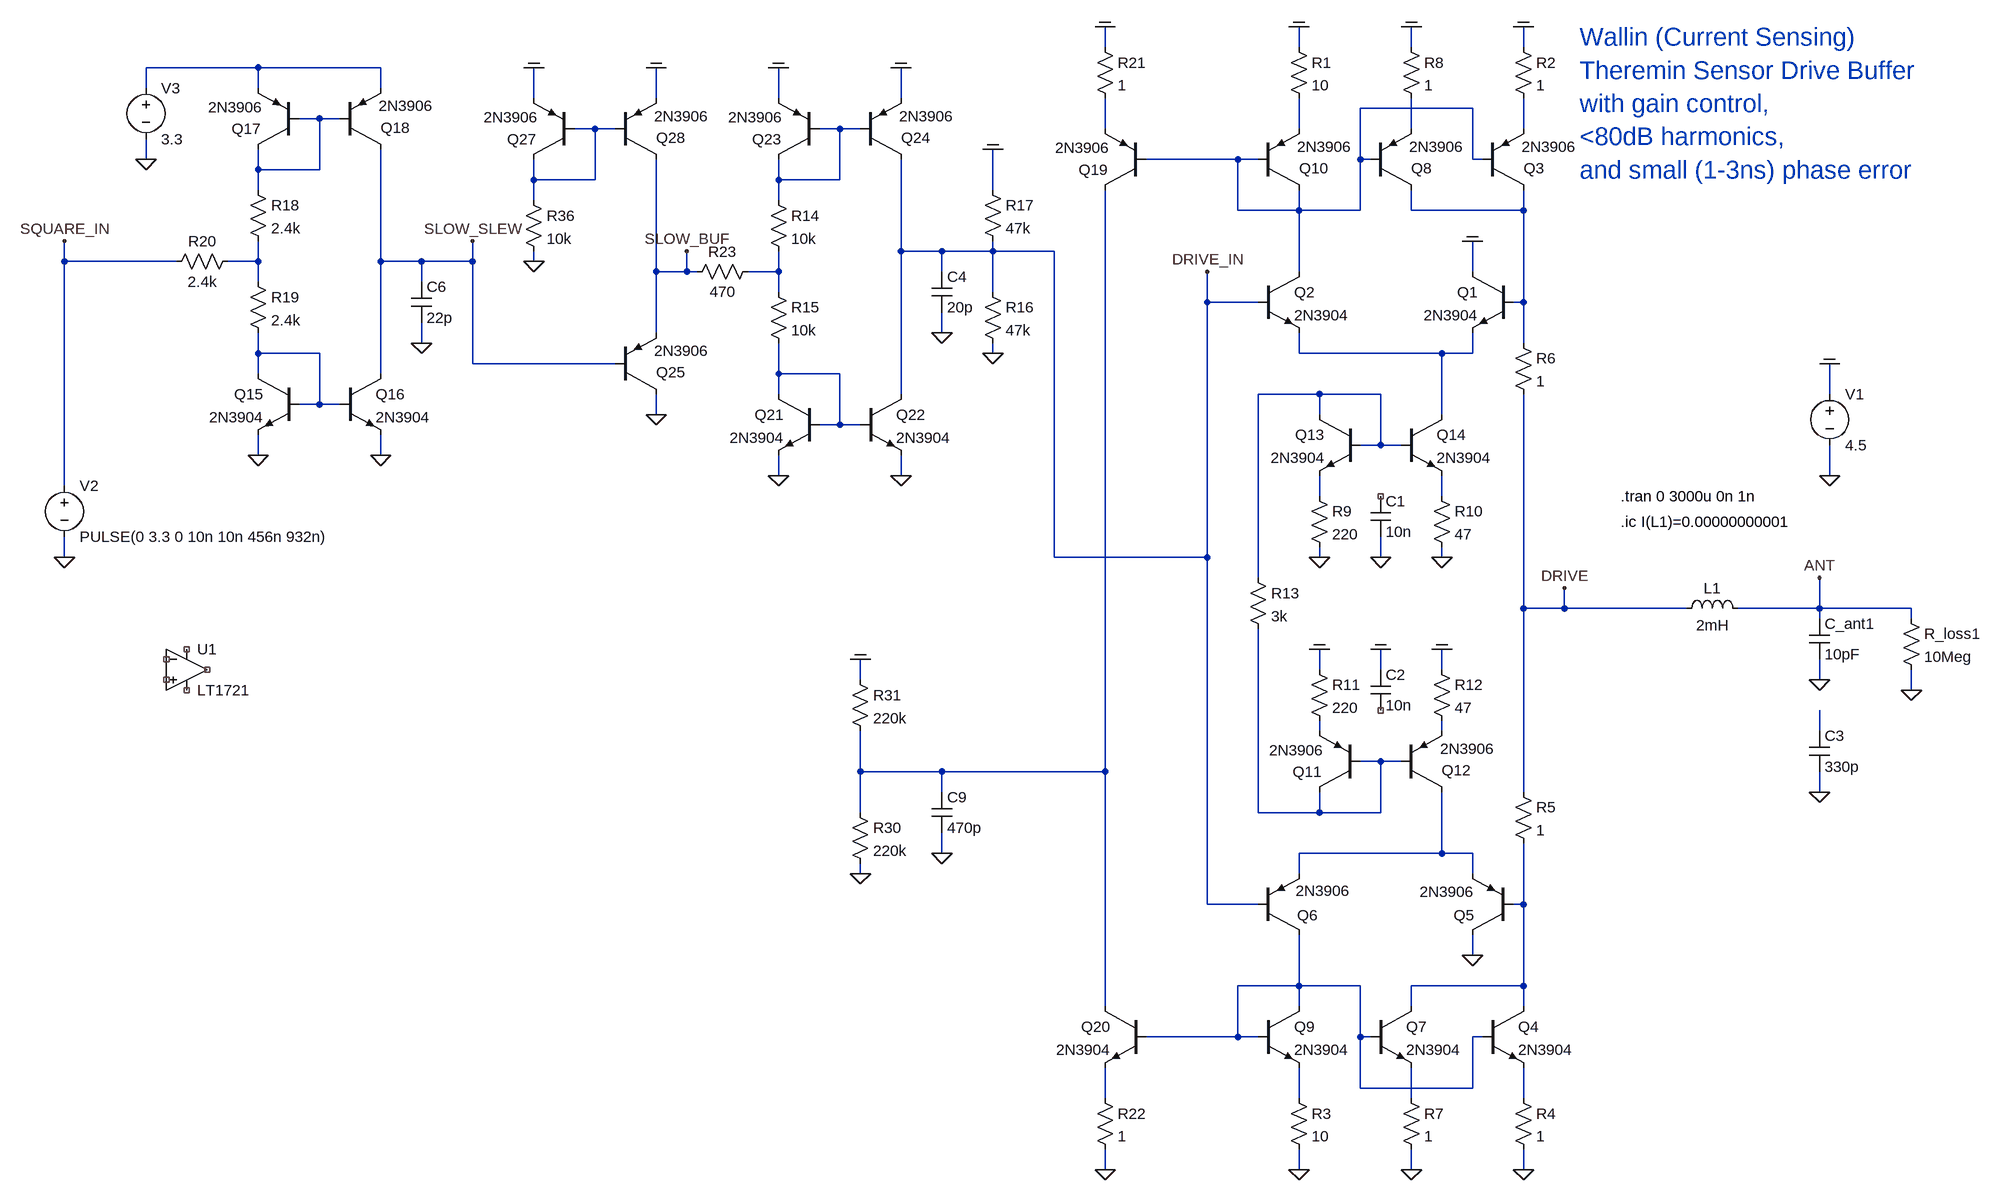
[diagram p0: schematic dlev_afe_bjt_current_sense.asc]
dlev_afe_bjt_current_sense.asc, the LTspice schematic file:
Version 4
SHEET 1 880 1584
WIRE -496 -192 -496 -224
WIRE -192 -192 -192 -224
WIRE -16 -192 -16 -224
WIRE 160 -192 160 -224
WIRE -1824 -160 -2000 -160
WIRE -1632 -160 -1824 -160
WIRE -2000 -128 -2000 -160
WIRE -1824 -128 -1824 -160
WIRE -1632 -128 -1632 -160
WIRE -1392 -112 -1392 -160
WIRE -1200 -112 -1200 -160
WIRE -1008 -112 -1008 -160
WIRE -816 -112 -816 -160
WIRE 80 -96 -96 -96
WIRE -1728 -80 -1760 -80
WIRE -1696 -80 -1728 -80
WIRE -1296 -64 -1328 -64
WIRE -1264 -64 -1296 -64
WIRE -912 -64 -944 -64
WIRE -880 -64 -912 -64
WIRE -496 -64 -496 -112
WIRE -192 -64 -192 -112
WIRE -16 -64 -16 -112
WIRE 160 -64 160 -112
WIRE -2000 -16 -2000 -48
WIRE -288 -16 -432 -16
WIRE -256 -16 -288 -16
WIRE -96 -16 -96 -96
WIRE -80 -16 -96 -16
WIRE 80 -16 80 -96
WIRE 96 -16 80 -16
WIRE -1824 0 -1824 -32
WIRE -1728 0 -1728 -80
WIRE -1728 0 -1824 0
WIRE -1392 16 -1392 -16
WIRE -1296 16 -1296 -64
WIRE -1296 16 -1392 16
WIRE -1008 16 -1008 -16
WIRE -912 16 -912 -64
WIRE -912 16 -1008 16
WIRE -1824 32 -1824 0
WIRE -672 32 -672 -32
WIRE -1392 48 -1392 16
WIRE -1008 48 -1008 16
WIRE -288 64 -288 -16
WIRE -192 64 -192 32
WIRE -192 64 -288 64
WIRE -96 64 -96 -16
WIRE -96 64 -192 64
WIRE -16 64 -16 32
WIRE 160 64 160 32
WIRE 160 64 -16 64
WIRE -816 128 -816 -16
WIRE -752 128 -816 128
WIRE -672 128 -672 112
WIRE -672 128 -752 128
WIRE -576 128 -672 128
WIRE -2128 144 -2128 112
WIRE -1952 144 -2128 144
WIRE -1824 144 -1824 112
WIRE -1824 144 -1872 144
WIRE -1632 144 -1632 -32
WIRE -1568 144 -1632 144
WIRE -1488 144 -1488 112
WIRE -1488 144 -1568 144
WIRE -1392 144 -1392 128
WIRE -1200 160 -1200 -16
WIRE -1152 160 -1152 128
WIRE -1152 160 -1200 160
WIRE -1136 160 -1152 160
WIRE -1008 160 -1008 128
WIRE -1008 160 -1056 160
WIRE -752 160 -752 128
WIRE -192 160 -192 64
WIRE 80 160 80 112
WIRE -1824 176 -1824 144
WIRE -1568 176 -1568 144
WIRE -1008 192 -1008 160
WIRE -672 192 -672 128
WIRE -336 208 -336 160
WIRE -256 208 -336 208
WIRE 160 208 160 64
WIRE 160 208 144 208
WIRE -1200 256 -1200 160
WIRE -752 256 -752 224
WIRE -1568 272 -1568 240
WIRE 160 272 160 208
WIRE -1824 288 -1824 256
WIRE -1728 288 -1824 288
WIRE -672 288 -672 272
WIRE -192 288 -192 256
WIRE 32 288 -192 288
WIRE 80 288 80 256
WIRE 80 288 32 288
WIRE -1488 304 -1488 144
WIRE -1264 304 -1488 304
WIRE -1824 320 -1824 288
WIRE -1632 320 -1632 144
WIRE -1008 320 -1008 272
WIRE -912 320 -1008 320
WIRE -1008 352 -1008 320
WIRE -816 352 -816 128
WIRE -160 352 -256 352
WIRE -64 352 -160 352
WIRE 640 352 640 304
WIRE -1728 368 -1728 288
WIRE -1728 368 -1760 368
WIRE -1696 368 -1728 368
WIRE -1200 384 -1200 352
WIRE -160 384 -160 352
WIRE 32 384 32 288
WIRE -912 400 -912 320
WIRE -912 400 -944 400
WIRE -880 400 -912 400
WIRE -64 432 -64 352
WIRE -64 432 -96 432
WIRE -32 432 -64 432
WIRE -1824 448 -1824 416
WIRE -1632 448 -1632 416
WIRE -1008 480 -1008 448
WIRE -816 480 -816 448
WIRE 640 480 640 432
WIRE -2128 496 -2128 144
WIRE -160 512 -160 480
WIRE 32 512 32 480
WIRE -2128 608 -2128 576
WIRE -576 608 -576 128
WIRE -336 608 -336 208
WIRE -336 608 -576 608
WIRE -160 608 -160 592
WIRE -64 608 -64 576
WIRE 32 608 32 592
WIRE -256 640 -256 352
WIRE 160 688 160 352
WIRE 224 688 224 656
WIRE 224 688 160 688
WIRE 416 688 224 688
WIRE 624 688 624 640
WIRE 624 688 496 688
WIRE 768 688 624 688
WIRE 624 704 624 688
WIRE 768 704 768 688
WIRE -160 784 -160 752
WIRE -64 784 -64 752
WIRE 32 784 32 752
WIRE -880 800 -880 768
WIRE 624 800 624 768
WIRE 768 816 768 784
WIRE -160 880 -160 864
WIRE 32 880 32 864
WIRE 624 880 624 848
WIRE -64 928 -96 928
WIRE -32 928 -64 928
WIRE -880 944 -880 880
WIRE -752 944 -880 944
WIRE -496 944 -496 32
WIRE -496 944 -752 944
WIRE -752 976 -752 944
WIRE 160 976 160 688
WIRE 624 976 624 944
WIRE -880 1008 -880 944
WIRE -256 1008 -256 720
WIRE -160 1008 -160 976
WIRE -160 1008 -256 1008
WIRE -64 1008 -64 928
WIRE -64 1008 -160 1008
WIRE -752 1072 -752 1040
WIRE 32 1072 32 976
WIRE 32 1072 -192 1072
WIRE 80 1072 32 1072
WIRE -880 1104 -880 1088
WIRE -192 1104 -192 1072
WIRE 80 1104 80 1072
WIRE -336 1152 -336 608
WIRE -256 1152 -336 1152
WIRE 160 1152 160 1056
WIRE 160 1152 144 1152
WIRE 80 1232 80 1200
WIRE -192 1280 -192 1200
WIRE -192 1280 -288 1280
WIRE -96 1280 -192 1280
WIRE 160 1280 160 1152
WIRE 160 1280 -16 1280
WIRE -496 1312 -496 944
WIRE -192 1312 -192 1280
WIRE -16 1312 -16 1280
WIRE 160 1312 160 1280
WIRE -288 1360 -288 1280
WIRE -288 1360 -432 1360
WIRE -256 1360 -288 1360
WIRE -96 1360 -96 1280
WIRE -80 1360 -96 1360
WIRE 96 1360 80 1360
WIRE -96 1440 -96 1360
WIRE 80 1440 80 1360
WIRE 80 1440 -96 1440
WIRE -496 1456 -496 1408
WIRE -192 1456 -192 1408
WIRE -16 1456 -16 1408
WIRE 160 1456 160 1408
WIRE -496 1568 -496 1536
WIRE -192 1568 -192 1536
WIRE -16 1568 -16 1536
WIRE 160 1568 160 1536
FLAG 640 480 0
FLAG 640 304 COM
FLAG -192 -224 COM
FLAG 160 -224 COM
FLAG 80 112 COM
FLAG -192 1568 0
FLAG 160 1568 0
FLAG 80 1232 0
FLAG 624 800 0
FLAG 624 640 ANT
FLAG 224 656 DRIVE
FLAG 768 816 0
FLAG -336 160 DRIVE_IN
FLAG -16 1568 0
FLAG -16 -224 COM
FLAG -160 752 COM
FLAG 32 752 COM
FLAG -160 608 0
FLAG 32 608 0
FLAG -64 608 0
FLAG -64 752 COM
FLAG 624 976 0
FLAG -2128 608 0
FLAG -1824 448 0
FLAG -1632 448 0
FLAG -1568 272 0
FLAG -2000 -16 0
FLAG -880 1104 0
FLAG -752 1072 0
FLAG -1392 -160 COM
FLAG -1200 -160 COM
FLAG -1392 144 0
FLAG -1200 384 0
FLAG -496 -224 COM
FLAG -496 1568 0
FLAG -880 768 COM
FLAG -1008 480 0
FLAG -816 480 0
FLAG -752 256 0
FLAG -1008 -160 COM
FLAG -816 -160 COM
FLAG -672 288 0
FLAG -672 -32 COM
FLAG -2128 112 SQUARE_IN
FLAG -1488 112 SLOW_SLEW
FLAG -1152 128 SLOW_BUF
SYMBOL voltage 640 336 R0
SYMATTR InstName V1
SYMATTR Value 4.5
SYMBOL npn 144 160 M0
SYMATTR InstName Q1
SYMATTR Value 2N3904
SYMBOL npn -256 160 R0
SYMATTR InstName Q2
SYMATTR Value 2N3904
SYMBOL Res -208 -208 R0
SYMATTR InstName R1
SYMATTR Value 10
SYMBOL pnp 96 32 M180
WINDOW 0 64 34 Left 2
WINDOW 3 61 68 Left 2
SYMATTR InstName Q3
SYMATTR Value 2N3906
SYMBOL Res 144 -208 R0
SYMATTR InstName R2
SYMATTR Value 1
SYMBOL npn 96 1312 R0
SYMATTR InstName Q4
SYMATTR Value 2N3904
SYMBOL Res -208 1440 R0
SYMATTR InstName R3
SYMATTR Value 10
SYMBOL Res 144 1440 R0
SYMATTR InstName R4
SYMATTR Value 1
SYMBOL pnp 144 1200 R180
WINDOW 0 61 31 Left 2
WINDOW 3 62 68 Left 2
SYMATTR InstName Q5
SYMATTR Value 2N3906
SYMBOL pnp -256 1200 M180
WINDOW 0 61 31 Left 2
WINDOW 3 59 69 Left 2
SYMATTR InstName Q6
SYMATTR Value 2N3906
SYMBOL Res 144 960 R0
SYMATTR InstName R5
SYMATTR Value 1
SYMBOL Res 144 256 R0
SYMATTR InstName R6
SYMATTR Value 1
SYMBOL ind 400 704 R270
WINDOW 0 32 56 VTop 2
WINDOW 3 5 56 VBottom 2
SYMATTR InstName L1
SYMATTR Value 2mH
SYMATTR SpiceLine Rser=120 Cpar=1pF
SYMBOL Cap 608 704 R0
SYMATTR InstName C_ant1
SYMATTR Value 10pF
SYMBOL Res 752 688 R0
SYMATTR InstName R_loss1
SYMATTR Value 10Meg
SYMBOL npn -80 1312 R0
SYMATTR InstName Q7
SYMATTR Value 2N3904
SYMBOL Res -32 1440 R0
SYMATTR InstName R7
SYMATTR Value 1
SYMBOL pnp -80 32 M180
WINDOW 0 64 34 Left 2
WINDOW 3 61 68 Left 2
SYMATTR InstName Q8
SYMATTR Value 2N3906
SYMBOL Res -32 -208 R0
SYMATTR InstName R8
SYMATTR Value 1
SYMBOL npn -256 1312 R0
SYMATTR InstName Q9
SYMATTR Value 2N3904
SYMBOL pnp -256 32 M180
WINDOW 0 64 34 Left 2
WINDOW 3 61 68 Left 2
SYMATTR InstName Q10
SYMATTR Value 2N3906
SYMBOL pnp -96 976 R180
WINDOW 0 60 32 Left 2
WINDOW 3 58 66 Left 2
SYMATTR InstName Q11
SYMATTR Value 2N3906
SYMBOL pnp -32 976 M180
WINDOW 0 64 34 Left 2
WINDOW 3 61 68 Left 2
SYMATTR InstName Q12
SYMATTR Value 2N3906
SYMBOL npn -96 384 M0
SYMATTR InstName Q13
SYMATTR Value 2N3904
SYMBOL npn -32 384 R0
SYMATTR InstName Q14
SYMATTR Value 2N3904
SYMBOL Res -176 496 R0
SYMATTR InstName R9
SYMATTR Value 220
SYMBOL Res 16 496 R0
SYMATTR InstName R10
SYMATTR Value 47
SYMBOL Res -176 768 R0
SYMATTR InstName R11
SYMATTR Value 220
SYMBOL Res 16 768 R0
SYMATTR InstName R12
SYMATTR Value 47
SYMBOL Res -272 624 R0
SYMATTR InstName R13
SYMATTR Value 3k
SYMBOL Cap -80 512 R0
SYMATTR InstName C1
SYMATTR Value 10n
SYMBOL Cap -80 784 R0
SYMATTR InstName C2
SYMATTR Value 10n
SYMBOL Cap 608 880 R0
SYMATTR InstName C3
SYMATTR Value 330p
SYMBOL Voltage -2128 480 R0
SYMATTR InstName V2
SYMATTR Value PULSE(0 3.3 0 10n 10n 456n 932n)
SYMBOL Voltage -2000 -144 R0
SYMATTR InstName V3
SYMATTR Value 3.3
SYMBOL npn -1760 320 M0
SYMATTR InstName Q15
SYMATTR Value 2N3904
SYMBOL npn -1696 320 R0
SYMATTR InstName Q16
SYMATTR Value 2N3904
SYMBOL pnp -1760 -32 R180
WINDOW 0 60 32 Left 2
WINDOW 3 58 66 Left 2
SYMATTR InstName Q17
SYMATTR Value 2N3906
SYMBOL pnp -1696 -32 M180
WINDOW 0 64 34 Left 2
WINDOW 3 61 68 Left 2
SYMATTR InstName Q18
SYMATTR Value 2N3906
SYMBOL Res -1840 16 R0
SYMATTR InstName R18
SYMATTR Value 2.4k
SYMBOL Res -1840 160 R0
SYMATTR InstName R19
SYMATTR Value 2.4k
SYMBOL Cap -1584 176 R0
SYMATTR InstName C6
SYMATTR Value 22p
SYMBOL Res -1856 128 R90
WINDOW 0 0 56 VBottom 2
WINDOW 3 32 56 VTop 2
SYMATTR InstName R20
SYMATTR Value 2.4k
SYMBOL Res -896 992 R0
SYMATTR InstName R30
SYMATTR Value 220k
SYMBOL Res -896 784 R0
SYMATTR InstName R31
SYMATTR Value 220k
SYMBOL Cap -768 976 R0
SYMATTR InstName C9
SYMATTR Value 470p
SYMBOL pnp -1328 -16 R180
WINDOW 0 60 32 Left 2
WINDOW 3 58 66 Left 2
SYMATTR InstName Q27
SYMATTR Value 2N3906
SYMBOL pnp -1264 -16 M180
WINDOW 0 64 34 Left 2
WINDOW 3 61 68 Left 2
SYMATTR InstName Q28
SYMATTR Value 2N3906
SYMBOL Res -1408 32 R0
SYMATTR InstName R36
SYMATTR Value 10k
SYMBOL pnp -1264 352 M180
WINDOW 0 64 34 Left 2
WINDOW 3 61 68 Left 2
SYMATTR InstName Q25
SYMATTR Value 2N3906
SYMBOL Res -512 -208 R0
SYMATTR InstName R21
SYMATTR Value 1
SYMBOL pnp -432 32 R180
WINDOW 0 60 32 Left 2
WINDOW 3 58 66 Left 2
SYMATTR InstName Q19
SYMATTR Value 2N3906
SYMBOL npn -432 1312 M0
SYMATTR InstName Q20
SYMATTR Value 2N3904
SYMBOL Res -512 1440 R0
SYMATTR InstName R22
SYMATTR Value 1
SYMBOL npn -944 352 M0
SYMATTR InstName Q21
SYMATTR Value 2N3904
SYMBOL npn -880 352 R0
SYMATTR InstName Q22
SYMATTR Value 2N3904
SYMBOL pnp -944 -16 R180
WINDOW 0 60 32 Left 2
WINDOW 3 58 66 Left 2
SYMATTR InstName Q23
SYMATTR Value 2N3906
SYMBOL pnp -880 -16 M180
WINDOW 0 64 34 Left 2
WINDOW 3 61 68 Left 2
SYMATTR InstName Q24
SYMATTR Value 2N3906
SYMBOL Res -1024 32 R0
SYMATTR InstName R14
SYMATTR Value 10k
SYMBOL Res -1024 176 R0
SYMATTR InstName R15
SYMATTR Value 10k
SYMBOL Cap -768 160 R0
SYMATTR InstName C4
SYMATTR Value 20p
SYMBOL Res -688 176 R0
SYMATTR InstName R16
SYMATTR Value 47k
SYMBOL Res -688 16 R0
SYMATTR InstName R17
SYMATTR Value 47k
SYMBOL Res -1040 144 R90
WINDOW 0 0 56 VBottom 2
WINDOW 3 32 56 VTop 2
SYMATTR InstName R23
SYMATTR Value 470
SYMBOL Comparators/LT1721 -1936 720 R0
SYMATTR InstName U1
TEXT 312 512 Left 2 !.tran 0 3000u 0n 1n
TEXT 312 552 Left 2 !.ic I(L1)=0.00000000001
TEXT 248 -208 Left 4 ;Wallin (Current Sensing) \nTheremin Sensor Drive Buffer\nwith gain control, \n<80dB harmonics,\nand small (1-3ns) phase error

The netlist it stands for:
* dlev_afe_bjt_current_sense.asc
V1 COM 0 4.5
Q1 COM N010 N014 0 2N3904
Q2 N002 DRIVE_IN N014 0 2N3904
R1 COM N007 10
Q3 N010 N002 N009 0 2N3906
R2 COM N009 1
Q4 N025 N026 N030 0 2N3904
R3 N028 0 10
R4 N030 0 1
Q5 0 N025 N024 0 2N3906
Q6 N026 DRIVE_IN N024 0 2N3906
R5 DRIVE N025 1
R6 N010 DRIVE 1
L1 DRIVE ANT 2mH Rser=120 Cpar=1pF
C_ant1 ANT 0 10pF
R_loss1 ANT 0 10Meg
Q7 N025 N026 N029 0 2N3904
R7 N029 0 1
Q8 N010 N002 N008 0 2N3906
R8 COM N008 1
Q9 N026 N026 N028 0 2N3904
Q10 N002 N002 N007 0 2N3906
Q11 N022 N022 N019 0 2N3906
Q12 N024 N022 N020 0 2N3906
Q13 N016 N016 N017 0 2N3904
Q14 N014 N016 N018 0 2N3904
R9 N017 0 220
R10 N018 0 47
R11 COM N019 220
R12 COM N020 47
R13 N016 N022 3k
C1 NC_01 0 10n
C2 COM NC_02 10n
C3 N021 0 330p
V2 SQUARE_IN 0 PULSE(0 3.3 0 10n 10n 456n 932n)
V3 N001 0 3.3
Q15 N013 N013 0 0 2N3904
Q16 SLOW_SLEW N013 0 0 2N3904
Q17 N003 N003 N001 0 2N3906
Q18 SLOW_SLEW N003 N001 0 2N3906
R18 N003 N011 2.4k
R19 N011 N013 2.4k
C6 SLOW_SLEW 0 22p
R20 N011 SQUARE_IN 2.4k
R30 N023 0 220k
R31 COM N023 220k
C9 N023 0 470p
Q27 N004 N004 COM 0 2N3906
Q28 SLOW_BUF N004 COM 0 2N3906
R36 N004 0 10k
Q25 0 SLOW_SLEW SLOW_BUF 0 2N3906
R21 COM N006 1
Q19 N023 N002 N006 0 2N3906
Q20 N023 N026 N027 0 2N3904
R22 N027 0 1
Q21 N015 N015 0 0 2N3904
Q22 DRIVE_IN N015 0 0 2N3904
Q23 N005 N005 COM 0 2N3906
Q24 DRIVE_IN N005 COM 0 2N3906
R14 N005 N012 10k
R15 N012 N015 10k
C4 DRIVE_IN 0 20p
R16 DRIVE_IN 0 47k
R17 COM DRIVE_IN 47k
R23 N012 SLOW_BUF 470
XU1 NC_03 NC_04 NC_05 NC_06 NC_07 LT1720  ; LT1721, pins In+ In- V+ V- OUT
.model NPN NPN
.model PNP PNP
.lib standard.bjt
.tran 0 3000u 0n 1n
.ic I(L1)=0.00000000001
* Wallin (Current Sensing)
* Theremin Sensor Drive Buffer
* with gain control,
* <80dB harmonics,
* and small (1-3ns) phase error
.lib LTC.lib
.backanno
.end